# Altium schematic sheet Driver-BTN7971.SchDoc
size A4
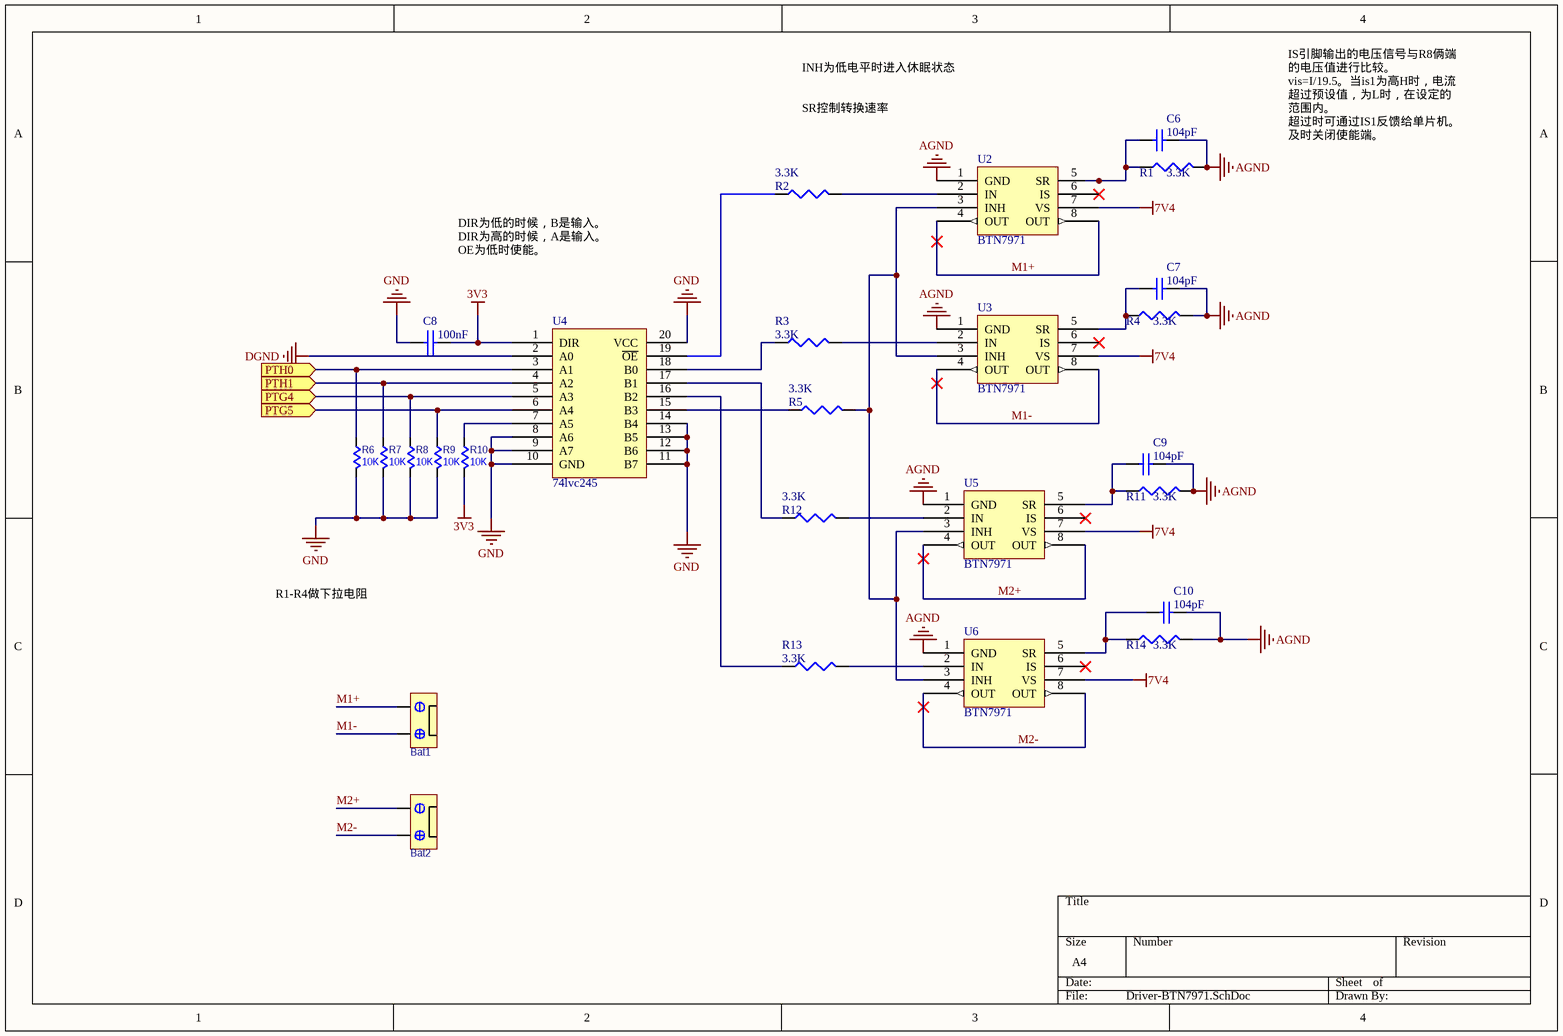
[diagram p0: Driver-BTN7971.SchDoc]

## Parts
Bat1  Battery  [BatConn]  (value not drawn)
Bat2  Battery  [BatConn]  (value not drawn)
C6  value 104pF  [0603]  (hidden comment: Cap Semi)
C7  value 104pF  [0603]  (hidden comment: Cap Semi)
C8  100nF  [0603]
C9  value 104pF  [0603]  (hidden comment: Cap Semi)
C10  value 104pF  [0603]  (hidden comment: Cap Semi)
R1  value 3.3K  [0603]  (hidden comment: Res3)
R2  value 3.3K  [0603]  (hidden comment: Res3)
R3  value 3.3K  [0603]  (hidden comment: Res3)
R4  value 3.3K  [0603]  (hidden comment: Res3)
R5  value 3.3K  [0603]  (hidden comment: Res3)
R6  value 10K  [0603]  (hidden comment: Res)
R7  value 10K  [0603]  (hidden comment: Res)
R8  value 10K  [0603]  (hidden comment: Res)
R9  value 10K  [0603]  (hidden comment: Res)
R10  value 10K  [0603]  (hidden comment: Res)
R11  value 3.3K  [0603]  (hidden comment: Res3)
R12  value 3.3K  [0603]  (hidden comment: Res3)
R13  value 3.3K  [0603]  (hidden comment: Res3)
R14  value 3.3K  [0603]  (hidden comment: Res3)
U2  BTN7971  [TO263-7]
U3  BTN7971  [TO263-7]
U4  74lvc245  [74lvc245 TSSOP]
U5  BTN7971  [TO263-7]
U6  BTN7971  [TO263-7]

## Ports
PTG4 (in), PTG5 (in), PTH0 (in), PTH1 (in)

## Nets
3V3: C8.2 R10.2 U4.1(DIR)
7V4: U2.7(VS) U3.7(VS) U5.7(VS) U6.7(VS)
AGND: C6.2 C7.2 C9.2 C10.2 R1.2 R4.2 R11.2 R14.2 U2.1(GND) U3.1(GND) U5.1(GND) U6.1(GND)
DGND: U4.2(A0)
GND: C8.1 R6.2 R7.2 R8.2 R9.2 U4.8(A6) U4.9(A7) U4.10(GND) U4.11(B7) U4.12(B6) U4.13(B5) U4.14(B4) U4.20(VCC)
M1+: Bat1.2 U2.4(OUT) U2.8(OUT)
M1-: Bat1.1 U3.4(OUT) U3.8(OUT)
M2+: Bat2.2 U5.4(OUT) U5.8(OUT)
M2-: Bat2.1 U6.4(OUT) U6.8(OUT)
PTG4: R8.1 U4.5(A3) ; port PTG4
PTG5: R9.1 U4.6(A4) ; port PTG5
PTH0: R6.1 U4.3(A1) ; port PTH0
PTH1: R7.1 U4.4(A2) ; port PTH1
NetC6_1: C6.1 R1.1 U2.5(SR)
NetC7_1: C7.1 R4.1 U3.5(SR)
NetC9_1: C9.1 R11.1 U5.5(SR)
NetC10_1: C10.1 R14.1 U6.5(SR)
NetR2_1: R2.1 U4.19(~{OE})
NetR2_2: R2.2 U2.2(IN)
NetR3_1: R3.1 U4.18(B0)
NetR3_2: R3.2 U3.2(IN)
NetR5_1: R5.1 U4.15(B3)
NetR5_2: R5.2 U2.3(INH) U3.3(INH) U5.3(INH) U6.3(INH)
NetR10_1: R10.1 U4.7(A5)
NetR12_1: R12.1 U4.17(B1)
NetR12_2: R12.2 U5.2(IN)
NetR13_1: R13.1 U4.16(B2)
NetR13_2: R13.2 U6.2(IN)

Not connected (* = marked no-connect by the designer): U2 6(IS)*; U3 6(IS)*; U5 6(IS)*; U6 6(IS)*

## Notes on the sheet
- INH为低电平时进入休眠状态
- SR控制转换速率
- IS引脚输出的电压信号与R8俩端的电压值进行比较。
  vis=I/19.5。当is1为高H时，电流超过预设值，为L时，在设定的范围内。
  超过时可通过IS1反馈给单片机。及时关闭使能端。
- DIR为低的时候，B是输入。
  DIR为高的时候，A是输入。
  OE为低时使能。
- R1-R4做下拉电阻

## Library data of the parts
Bat1 Bat2 = Battery: 电源端子
C6 C7 C9 C10 = Cap Semi: Capacitor (Semiconductor SIM Model); Published: 8-Jun-2000; LatestRevisionDate: 17-Jul-2002; LatestRevisionNote: Re-released for DXP Platform.; PackageReference: C1206; Publisher: Altium Limited
C8 = Cap: Capacitor
R1-R5 R11-R14 = Res3: Resistor; Published: 8-Jun-2000; LatestRevisionDate: 04-Mar-2005; LatestRevisionNote: PCB Footprint replaced.; PackageReference: J1-0603; Publisher: Altium Limited
R6-R10 = Res: 常规电阻
U2 U3 U5 U6 = BTN7971: MOS
U4 = 74lvc245: 8位5伏转3.3伏电平转换芯片